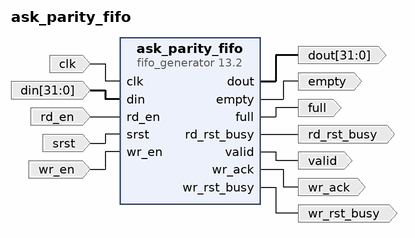
[diagram p0: block diagram of the top level]
# Vivado block design ask_parity_fifo, xcku5p-ffvb676-2-e, Vivado 2022.1
create_bd_design ask_parity_fifo

create_bd_port -dir I -type clk clk
create_bd_port -dir O rd_rst_busy
create_bd_port -dir I srst
create_bd_port -dir O valid
create_bd_port -dir O wr_ack
create_bd_port -dir O wr_rst_busy
create_bd_port -dir I wr_en
create_bd_port -dir I -from 31 -to 0 din
create_bd_port -dir O full
create_bd_port -dir I rd_en
create_bd_port -dir O -from 31 -to 0 dout
create_bd_port -dir O empty

create_bd_cell -type ip -vlnv xilinx.com:ip:fifo_generator:13.2 ask_parity_fifo
set_property -dict [list \
  CONFIG.Input_Data_Width 32 \
  CONFIG.Performance_Options First_Word_Fall_Through \
  CONFIG.Valid_Flag true \
  CONFIG.Write_Acknowledge_Flag true \
] [get_bd_cells ask_parity_fifo]

# ---- connections ----

connect_bd_net [get_bd_pins ask_parity_fifo/dout] [get_bd_ports dout]
connect_bd_net [get_bd_pins ask_parity_fifo/empty] [get_bd_ports empty]
connect_bd_net [get_bd_pins ask_parity_fifo/full] [get_bd_ports full]
connect_bd_net [get_bd_pins ask_parity_fifo/rd_rst_busy] [get_bd_ports rd_rst_busy]
connect_bd_net [get_bd_pins ask_parity_fifo/valid] [get_bd_ports valid]
connect_bd_net [get_bd_pins ask_parity_fifo/wr_ack] [get_bd_ports wr_ack]
connect_bd_net [get_bd_pins ask_parity_fifo/wr_rst_busy] [get_bd_ports wr_rst_busy]
connect_bd_net -net clk_0_1 [get_bd_ports clk] [get_bd_pins ask_parity_fifo/clk]
connect_bd_net -net din_0_1 [get_bd_ports din] [get_bd_pins ask_parity_fifo/din]
connect_bd_net -net rd_en_0_1 [get_bd_ports rd_en] [get_bd_pins ask_parity_fifo/rd_en]
connect_bd_net -net srst_0_1 [get_bd_ports srst] [get_bd_pins ask_parity_fifo/srst]
connect_bd_net -net wr_en_0_1 [get_bd_ports wr_en] [get_bd_pins ask_parity_fifo/wr_en]

validate_bd_design
save_bd_design
